# Altium schematic sheet ADC_part2.SchDoc
size A4
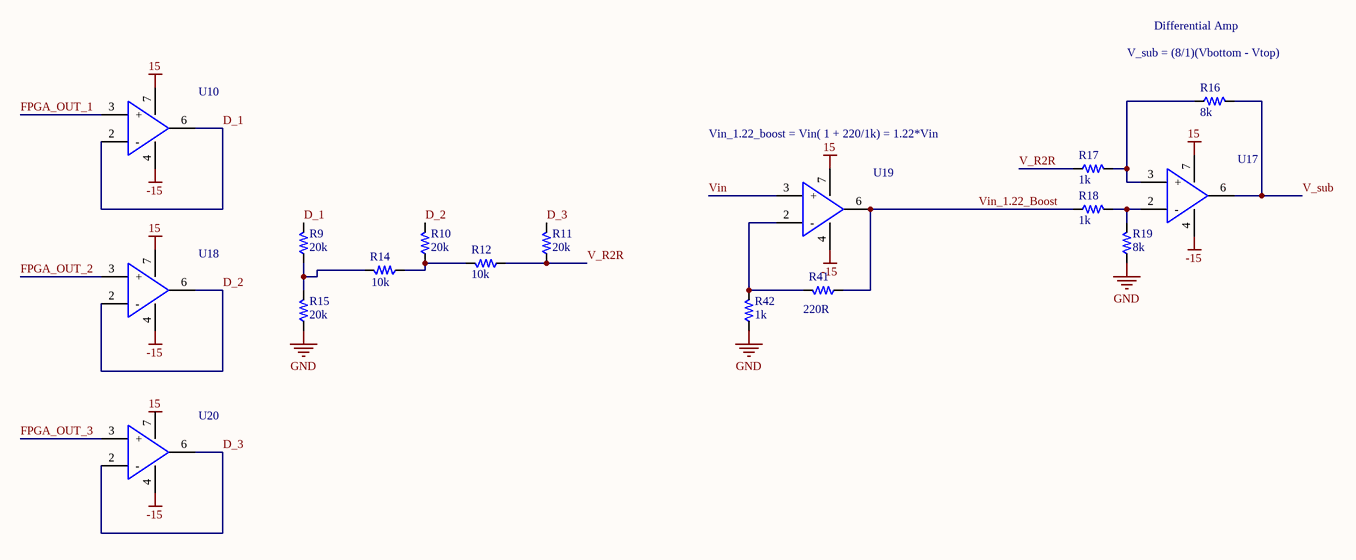
[diagram p0: ADC_part2.SchDoc]

## Parts
R9  value 20k  [PCB_GENERIC_SMD_0603]  (hidden comment: R060-00101-05)
R10  value 20k  [PCB_GENERIC_SMD_0603]  (hidden comment: R060-00101-05)
R11  value 20k  [PCB_GENERIC_SMD_0603]  (hidden comment: R060-00101-05)
R12  value 10k  [PCB_GENERIC_SMD_0603]  (hidden comment: R060-00101-05)
R14  value 10k  [PCB_GENERIC_SMD_0603]  (hidden comment: R060-00101-05)
R15  value 20k  [PCB_GENERIC_SMD_0603]  (hidden comment: R060-00101-05)
R16  value 8k  [PCB_GENERIC_SMD_0603]  (hidden comment: R060-00101-05)
R17  value 1k  [PCB_GENERIC_SMD_0603]  (hidden comment: R060-00101-05)
R18  value 1k  [PCB_GENERIC_SMD_0603]  (hidden comment: R060-00101-05)
R19  value 8k  [PCB_GENERIC_SMD_0603]  (hidden comment: R060-00101-05)
R41  value 220R  [PCB_GENERIC_SMD_0603]  (hidden comment: R060-00101-05)
R42  value 1k  [PCB_GENERIC_SMD_0603]  (hidden comment: R060-00101-05)
U10  AP331A  [SOT95P285X130-5N]  (value not drawn)
U17  AP331A  [SOT95P285X130-5N]  (value not drawn)
U18  AP331A  [SOT95P285X130-5N]  (value not drawn)
U19  AP331A  [SOT95P285X130-5N]  (value not drawn)
U20  AP331A  [SOT95P285X130-5N]  (value not drawn)

## Nets
15: U10.7(VCC) U17.7(VCC) U18.7(VCC) U19.7(VCC)
-15: U10.4(GND) U17.4(GND) U18.4(GND) U19.4(GND) U20.4(GND)
GND: R15.1 R19.1 R42.1
D_1: R9.2 U10.2(-) U10.6
D_2: R10.2 U18.2(-) U18.6
D_3: R11.2 U20.2(-) U20.6
FPGA_OUT_1: U10.3(+)
FPGA_OUT_2: U18.3(+)
FPGA_OUT_3: U20.3(+)
V_R2R: R11.1 R12.1 R17.1
V_sub: R16.2 U17.6
Vin: U19.3(+)
Vin_1.22_Boost: R18.1 R41.1 U19.6
NetR9_1: R9.1 R14.2 R15.2
NetR10_1: R10.1 R12.2 R14.1
NetR16_1: R16.1 R17.2 U17.3(+)
NetR18_2: R18.2 R19.2 U17.2(-)
NetR41_2: R41.2 R42.2 U19.2(-)

Not connected (* = marked no-connect by the designer): U20 7(VCC)

## Notes on the sheet
- (near R16) V_sub = (8/1)(Vbottom - Vtop)
- Differential Amp
- Vin_1.22_boost = Vin( 1 + 220/1k) = 1.22*Vin
- Labels drawn without touching a wire or pin: 15

## Library data of the parts
R9-R12 R14-R19 R41 R42 = R060-00101-05: RES 0603 100ohm 5% 63mW; Tolerance: 5%; Power: 63mW; Package: 0603
U10 U17-U20 = AP331A: Single Channel Comparator, Open Drain, SC-74A/SOT-753; Supplier 1: Digikey; Supplier Part Number 1: AP331AWGDICT-ND